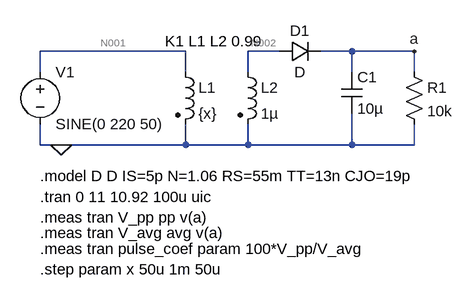
[diagram p0: schematic 1.2.1.asc]
1.2.1.asc, the LTspice schematic file:
Version 4
SHEET 1 880 680
WIRE 320 80 96 80
WIRE 464 80 416 80
WIRE 576 80 528 80
WIRE 672 80 576 80
WIRE 96 112 96 80
WIRE 320 112 320 80
WIRE 416 112 416 80
WIRE 576 112 576 80
WIRE 672 112 672 80
WIRE 96 224 96 192
WIRE 128 224 96 224
WIRE 320 224 320 192
WIRE 320 224 128 224
WIRE 416 224 416 192
WIRE 416 224 320 224
WIRE 576 224 576 176
WIRE 576 224 416 224
WIRE 672 224 672 192
WIRE 672 224 576 224
FLAG 128 224 0
FLAG 672 80 a
SYMBOL voltage 96 96 R0
WINDOW 123 0 0 Left 0
WINDOW 39 0 0 Left 0
SYMATTR InstName V1
SYMATTR Value SINE(0 220 50)
SYMBOL ind2 304 96 R0
SYMATTR InstName L1
SYMATTR Value {x}
SYMATTR SpiceLine Rser=10m
SYMATTR Type ind
SYMBOL ind2 400 96 R0
SYMATTR InstName L2
SYMATTR Value 1µ
SYMATTR SpiceLine Rser=10m
SYMATTR Type ind
SYMBOL diode 464 96 R270
WINDOW 0 32 32 VTop 2
WINDOW 3 0 32 VBottom 2
SYMATTR InstName D1
SYMBOL cap 560 112 R0
SYMATTR InstName C1
SYMATTR Value 10µ
SYMBOL res 656 96 R0
SYMATTR InstName R1
SYMATTR Value 10k
TEXT 96 272 Left 2 !.model D D IS=5p N=1.06 RS=55m TT=13n CJO=19p
TEXT 96 304 Left 2 !.tran 0 11 10.92 100u uic
TEXT 96 336 Left 2 !.meas tran V_pp pp v(a)
TEXT 96 360 Left 2 !.meas tran V_avg avg v(a)
TEXT 96 384 Left 2 !.meas tran pulse_coef param 100*V_pp/V_avg
TEXT 288 64 Left 2 !K1 L1 L2 0.99
TEXT 96 416 Left 2 !.step param x 50u 1m 50u

The netlist it stands for:
* 1.2.1.asc
V1 N001 0 SINE(0 220 50)
L1 N001 0 {x} Rser=10m
L2 N002 0 1µ Rser=10m
D1 N002 a D
C1 a 0 10µ
R1 a 0 10k
.model D D
.lib standard.dio
.model D D IS=5p N=1.06 RS=55m TT=13n CJO=19p
.tran 0 11 10.92 100u uic
.meas tran V_pp pp v(a)
.meas tran V_avg avg v(a)
.meas tran pulse_coef param 100*V_pp/V_avg
K1 L1 L2 0.99
.step param x 50u 1m 50u
.backanno
.end

* Results of the author's LTspice run, read from the files saved beside the schematic
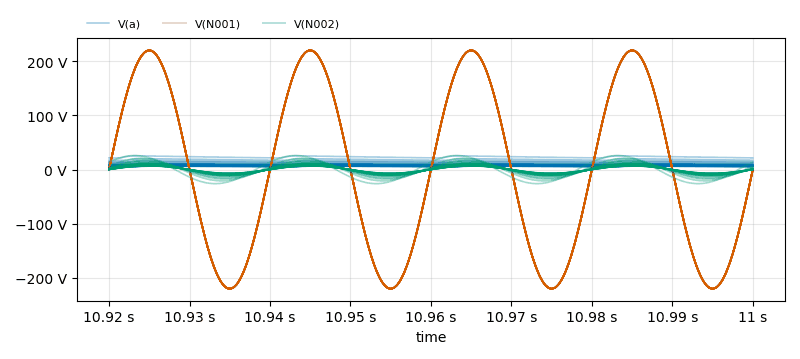
[diagram p1: Transient Analysis of 1.2.1.asc, plotted from the saved traces]
* Transient Analysis, 20 runs:
*   V(a) [run 1]: min 21.24 V, max 25.42 V, average 23.35 V, rms 23.38 V, last 21.53 V
*   V(a) [run 2]: min 16.88 V, max 20.2 V, average 18.56 V, rms 18.58 V, last 17.25 V
*   V(a) [run 3]: min 14.08 V, max 16.85 V, average 15.48 V, rms 15.5 V, last 14.44 V
*   V(a) [run 4]: min 12.26 V, max 14.66 V, average 13.47 V, rms 13.49 V, last 12.59 V
*   V(a) [run 5]: min 10 V, max 11.96 V, average 10.99 V, rms 11.01 V, last 10.29 V
*   V(a) [run 6]: min 9.244 V, max 11.05 V, average 10.16 V, rms 10.17 V, last 9.514 V
*   V(a) [run 7]: min 8.628 V, max 10.32 V, average 9.481 V, rms 9.494 V, last 8.884 V
*   V(a) [run 8]: min 8.116 V, max 9.705 V, average 8.918 V, rms 8.931 V, last 8.359 V
*   V(N001) [run 1]: min -220 V, max 220 V, average 15.99 mV, rms 155.6 V, last 0 V
*   V(N001) [run 2]: min -220 V, max 219.8 V, average 21.41 mV, rms 155.6 V, last 0 V
*   V(N001) [run 3]: min -220 V, max 220 V, average 21.67 mV, rms 155.6 V, last 0 V
*   V(N001) [run 4]: min -220 V, max 220 V, average 22.43 mV, rms 155.6 V, last 0 V
*   V(N001) [run 5]: min -220 V, max 220 V, average 23.89 mV, rms 155.6 V, last 0 V
*   V(N001) [run 6]: min -220 V, max 220 V, average 24.05 mV, rms 155.6 V, last 0 V
*   V(N001) [run 7]: min -220 V, max 220 V, average 22.54 mV, rms 155.6 V, last 0 V
*   V(N001) [run 8]: min -220 V, max 220 V, average 25.47 mV, rms 155.6 V, last 0 V
*   V(N002) [run 1]: min -25.98 V, max 25.98 V, average 2.845 mV, rms 18.37 V, last 13.95 V
*   V(N002) [run 2]: min -20.75 V, max 20.75 V, average 2.373 mV, rms 14.67 V, last 6.295 V
*   V(N002) [run 3]: min -17.39 V, max 17.39 V, average 1.893 mV, rms 12.3 V, last 3.611 V
*   V(N002) [run 4]: min -15.21 V, max 15.21 V, average 1.643 mV, rms 10.75 V, last 2.39 V
*   V(N002) [run 5]: min -12.5 V, max 12.5 V, average 1.423 mV, rms 8.841 V, last 1.319 V
*   V(N002) [run 6]: min -11.59 V, max 11.59 V, average 1.325 mV, rms 8.197 V, last 1.05 V
*   V(N002) [run 7]: min -10.85 V, max 10.85 V, average 1.159 mV, rms 7.676 V, last 861.1 mV
*   V(N002) [run 8]: min -10.24 V, max 10.24 V, average 1.221 mV, rms 7.241 V, last 722.6 mV
* From the log:
*   Measurement: v_pp
*     step  PP(v(a))  FROM  TO
*        1  4.18074  0  0.08
*        2  3.3186  0  0.08
*        3  2.76567  0  0.08
*        4  2.4056  0  0.08
*        5  2.15114  0  0.08
*        6  1.96046  0  0.08
*        7  1.81054  0  0.08
*        8  1.68916  0  0.08
*        9  1.58841  0  0.08
*       10  1.50224  0  0.08
*       11  1.42887  0  0.08
*       12  1.36464  0  0.08
*       13  1.30774  0  0.08
*       14  1.25692  0  0.08
*       15  1.21124  0  0.08
*       16  1.1701  0  0.08
*       17  1.13247  0  0.08
*       18  1.09778  0  0.08
*       19  1.06644  0  0.08
*       20  1.03706  0  0.08
*   Measurement: v_avg
*     step  AVG(v(a))  FROM  TO
*        1  23.3506  0  0.08
*        2  18.5551  0  0.08
*        3  15.4759  0  0.08
*        4  13.4714  0  0.08
*        5  12.0553  0  0.08
*        6  10.992  0  0.08
*        7  10.1576  0  0.08
*        8  9.48099  0  0.08
*        9  8.91837  0  0.08
*       10  8.44106  0  0.08
*       11  8.02956  0  0.08
*       12  7.67014  0  0.08
*       13  7.35268  0  0.08
*       14  7.06966  0  0.08
*       15  6.81519  0  0.08
*       16  6.58495  0  0.08
*       17  6.37517  0  0.08
*       18  6.18305  0  0.08
*       19  6.00628  0  0.08
*       20  5.8429  0  0.08
*   Measurement: pulse_coef
*     step  100*v_pp/v_avg
*        1  17.9042
*        2  17.8851
*        3  17.8708
*        4  17.8571
*        5  17.844
*        6  17.8353
*        7  17.8244
*        8  17.8163
*        9  17.8105
*       10  17.7968
*       11  17.7951
*       12  17.7916
*       13  17.7858
*       14  17.7791
*       15  17.7726
*       16  17.7693
*       17  17.7637
*       18  17.7546
*       19  17.7554
*       20  17.7491